# Altium schematic sheet Sheet1.SchDoc
size A4; SheetNumber: 1; SheetTotal: 1
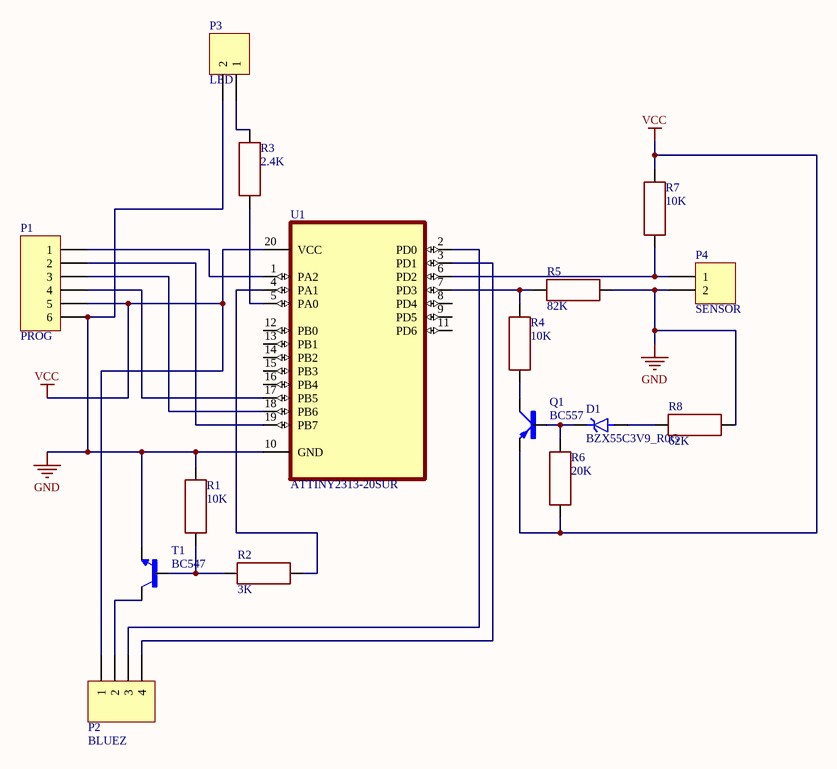
[diagram p0: Sheet1.SchDoc]

## Parts
D1  BZX55C3V9_R0G  [DIOAD928W47L399D179]
P1  PROG  [HDR1X6]
P2  BLUEZ  [HDR1X4]
P3  LED  [HDR1X2]
P4  SENSOR  [HDR1X2]
Q1  BC557  [SOT54A]
R1  10K  [RES 0805]
R2  3K  [RES 0805]
R3  2.4K  [RES 0805]
R4  10K  [RES 0805]
R5  82K  [RES 0805]
R6  20K  [RES 0805]
R7  10K  [RES 0805]
R8  62K  [RES 0805]
T1  BC547  [TO92]
U1  ATTINY2313-20SUR  [SOIC127P1032X265-20N]

## Nets
GND: P1.6 P3.2 P4.2 R1.2 R5.2 R8.2 T1.1(E) U1.10(GND)
VCC: P1.5 P2.1 Q1.E R6.1 R7.2 U1.20(VCC)
NetD1_A: D1.A R8.1
NetD1_C: D1.C(K) Q1.B R6.2
NetP1_1: P1.1 U1.1(PA2)
NetP1_2: P1.2 U1.19(PB7)
NetP1_3: P1.3 U1.18(PB6)
NetP1_4: P1.4 U1.17(PB5)
NetP2_2: P2.2 T1.3(C)
NetP2_3: P2.3 U1.2(PD0)
NetP2_4: P2.4 U1.3(PD1)
NetP3_1: P3.1 R3.2
NetP4_1: P4.1 R7.1 U1.6(PD2)
NetQ1_C: Q1.C R4.1
NetR1_1: R1.1 R2.1 T1.2(B)
NetR2_2: R2.2 U1.4(PA1)
NetR3_1: R3.1 U1.5(PA0)
NetR4_2: R4.2 R5.1 U1.7(PD3)

Not connected (* = marked no-connect by the designer): U1 8(PD4) 9(PD5) 11(PD6) 12(PB0) 13(PB1) 14(PB2) 15(PB3) 16(PB4)

## Library data of the parts
D1 = BZX55C3V9_R0G: MP: altium_native_batch; Value: *; Package: None; Price: None; Availability: Unavailable
P1 = Header 6: Header, 6-Pin; LatestRevisionDate: 17-Jul-2002; LatestRevisionNote: Re-released for DXP Platform.; Publisher: Altium Limited
P2 = Header 4: Header, 4-Pin; LatestRevisionDate: 17-Jul-2002; LatestRevisionNote: Re-released for DXP Platform.; Publisher: Altium Limited
P3 P4 = Header 2: Header, 2-Pin; LatestRevisionDate: 17-Jul-2002; LatestRevisionNote: Re-released for DXP Platform.; Publisher: Altium Limited
Q1 = BC557: Bipolar (BJT) Transistor PNP 45 V 100 mA 320MHz 625 mW Through Hole TO-92 (TO-226); MF: ON Semiconductor; SnapEDA_Link: https://www.snapeda.com/parts/BC557/Onsemi/view-part/?ref=snap; Package: E-PKG AXIAL-LEADED-2 ON Semiconductor; MP: BC557; Check_prices: https://www.snapeda.com/parts/BC557/Onsemi/view-part/?ref=eda; Purchase-URL: https://pricing.snapeda.com/search/part/BC557/?ref=eda; Price: None; Value: *; Availability: In Stock
R1-R8 = RES
T1 = BC547: Trans GP BJT NPN 45V 0.1A 500mW 3-Pin TO-92 T/R; MF: ON Semiconductor; Package: None; MP: BC547; Check_prices: https://www.snapeda.com/parts/BC547/Onsemi/view-part/?ref=eda; Value: *; SnapEDA_Link: https://www.snapeda.com/parts/BC547/Onsemi/view-part/?ref=snap; Availability: In Stock; Price: None; Purchase-URL: https://pricing.snapeda.com/search/part/BC547/?ref=eda
U1 = ATTINY2313-20SUR: AVR series Microcontroller IC 8-Bit 20MHz 2KB (1K x 16) FLASH 20-SOIC; MF: Microchip Technology; Check_prices: https://www.snapeda.com/parts/ATTINY2313-20SUR/Microchip/view-part/?ref=eda; Value: *; Availability: In Stock; MP: ATTINY2313-20SUR; Price: None; Package: SOIC-20 Microchip Technology; SnapEDA_Link: https://www.snapeda.com/parts/ATTINY2313-20SUR/Microchip/view-part/?ref=snap; Purchase-URL: https://pricing.snapeda.com/search/part/ATTINY2313-20SUR/?ref=eda